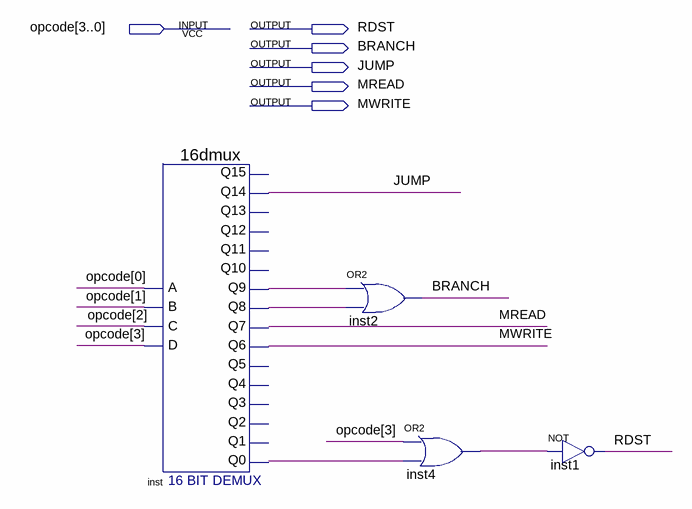
[diagram p0: schematic sheet]
// Quartus schematic Control2.bdf as structural Verilog: 4 symbols, 6 pins
module Control2 (
  input  [3:0] opcode,
  output RDST,
  output BRANCH,
  output JUMP,
  output MREAD,
  output MWRITE
);

  wire inst4_out, inst_q0, inst_q8, inst_q9;

  \16dmux  inst (
    .C(opcode[2]), .B(opcode[1]), .A(opcode[0]), .D(opcode[3]), .Q9(inst_q9), .Q7(MREAD), .Q8(inst_q8),
    .Q6(MWRITE), .Q14(JUMP), .Q0(inst_q0));  // open: Q12, Q13, Q11, Q10, Q4, Q5, Q2, Q3, Q15, Q1
  or inst2 (BRANCH, inst_q9, inst_q8);
  or inst4 (inst4_out, opcode[3], inst_q0);
  not inst1 (RDST, inst4_out);
endmodule
